# EAGLE design hmesh (EAGLE 6.5.0)
REV: A

## Sheet 1 of 3: CC110L
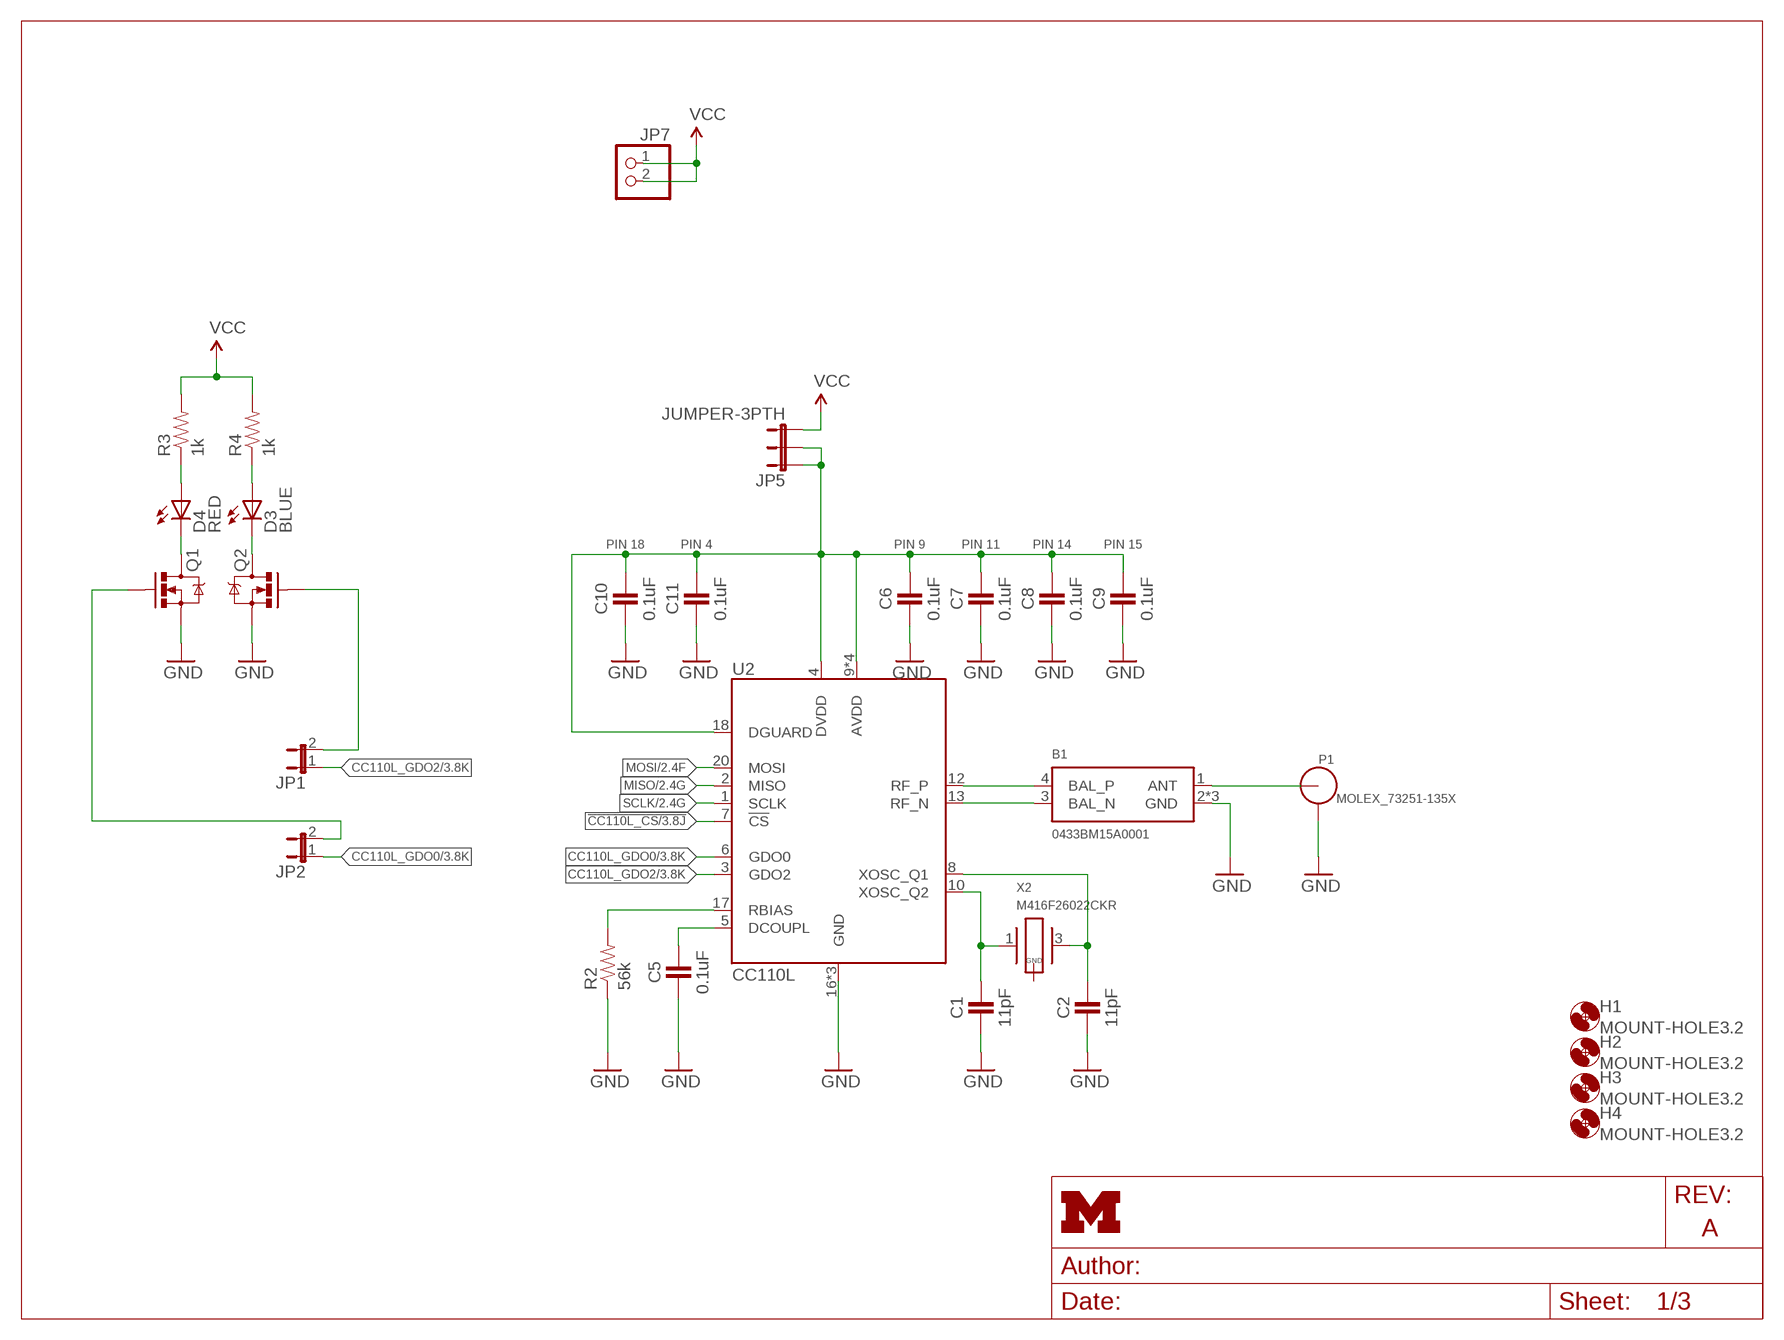
[diagram p0: schematic, sheet 1]
FRAME1 (LETTER_L): HEIGHT: 8.5in; WIDTH: 11in

### Parts
B1  0433BM15A0001  [2450BM]
C1  11pF  CAPACITOR  [0402_CAP]
C2  11pF  CAPACITOR  [0402_CAP]
C5  0.1uF  CAPACITOR  [0402_CAP]
C6  0.1uF  CAPACITOR  [0402_CAP]
C7  0.1uF  CAPACITOR  [0402_CAP]
C8  0.1uF  CAPACITOR  [0402_CAP]
C9  0.1uF  CAPACITOR  [0402_CAP]
C10  0.1uF  CAPACITOR  [0402_CAP]
C11  0.1uF  CAPACITOR  [0402_CAP]
D3  BLUE  LED0603  [LED-0603]
D4  RED  LED0603  [LED-0603]
H1  MOUNT-HOLE3.2  [3,2]
H2  MOUNT-HOLE3.2  [3,2]
H3  MOUNT-HOLE3.2  [3,2]
H4  MOUNT-HOLE3.2  [3,2]
JP1  JUMPER-2PTH  [1X02]
JP2  JUMPER-2PTH  [1X02]
JP5  JUMPER-3PTH  [1X03]
JP7  PINHD-1X2  [1X02]
P1  MOLEX_73251-135X  [SMA-J/PCB]
Q1  MOSFET-NCHANNELSMD  [SOT23-3]
Q2  MOSFET-NCHANNELSMD  [SOT23-3]
R2  56k  RESISTOR0402_RES  [0402_RES]
R3  1k  RESISTOR0402_RES  [0402_RES]
R4  1k  RESISTOR0402_RES  [0402_RES]
U2  CC110L  [S-PVQFN-N20]
X2  M416F26022CKR  [M416]

### Nets
!CC110L_CS: U2.7(!CS) ; also sheet 3
CC110L_GDO0: JP2.1 U2.6(GDO0) ; also sheet 3
CC110L_GDO2: JP1.1 U2.3(GDO2) ; also sheet 3
GND: B1.2(GND) B1.5(GND) B1.6(GND) C1.2 C2.2 C5.2 C6.2 C7.2 C8.2 C9.2 C10.2 C11.2 P1.2 P1.3 P1.4 P1.5 Q1.2(S) Q2.2(S) R2.1 U2.16(GND) U2.19(GND) U2.PAD(GND) ; also sheet 2,3
MISO: U2.2(MISO) ; also sheet 2,3
MOSI: U2.20(MOSI) ; also sheet 2,3
N$1: B1.4(BAL_P) U2.12(RF_P)
N$2: B1.3(BAL_N) U2.13(RF_N)
N$3: B1.1(ANT) P1.1(ANT)
N$6: C1.1 U2.10(XOSC_Q2) X2.1
N$8: C2.1 U2.8(XOSC_Q1) X2.3
N$9: C5.1 U2.5(DCOUPL)
N$10: R2.2 U2.17(RBIAS)
N$12: D4.C Q1.3(D)
N$13: D3.C Q2.3(D)
N$14: JP2.2 Q1.1(G)
N$15: JP1.2 Q2.1(G)
N$24: D4.A R3.1
N$25: D3.A R4.1
SCLK: U2.1(SCLK) ; also sheet 2,3
VCC: JP5.3 JP7.1 JP7.2 R3.2 R4.2 ; also sheet 2,3
VCC_CC110L: C6.1 C7.1 C8.1 C9.1 C10.1 C11.1 JP5.1 JP5.2 U2.4(DVDD) U2.9(AVDD) U2.11(AVDD) U2.14(AVDD) U2.15(AVDD) U2.18(DGUARD)
Unconnected: X2.2(GND) X2.4(GND)

### Notes on the sheet
- PIN 18 | PIN 4 | PIN 9 | PIN 11 | PIN 14 | PIN 15

## Sheet 2 of 3: AS3930
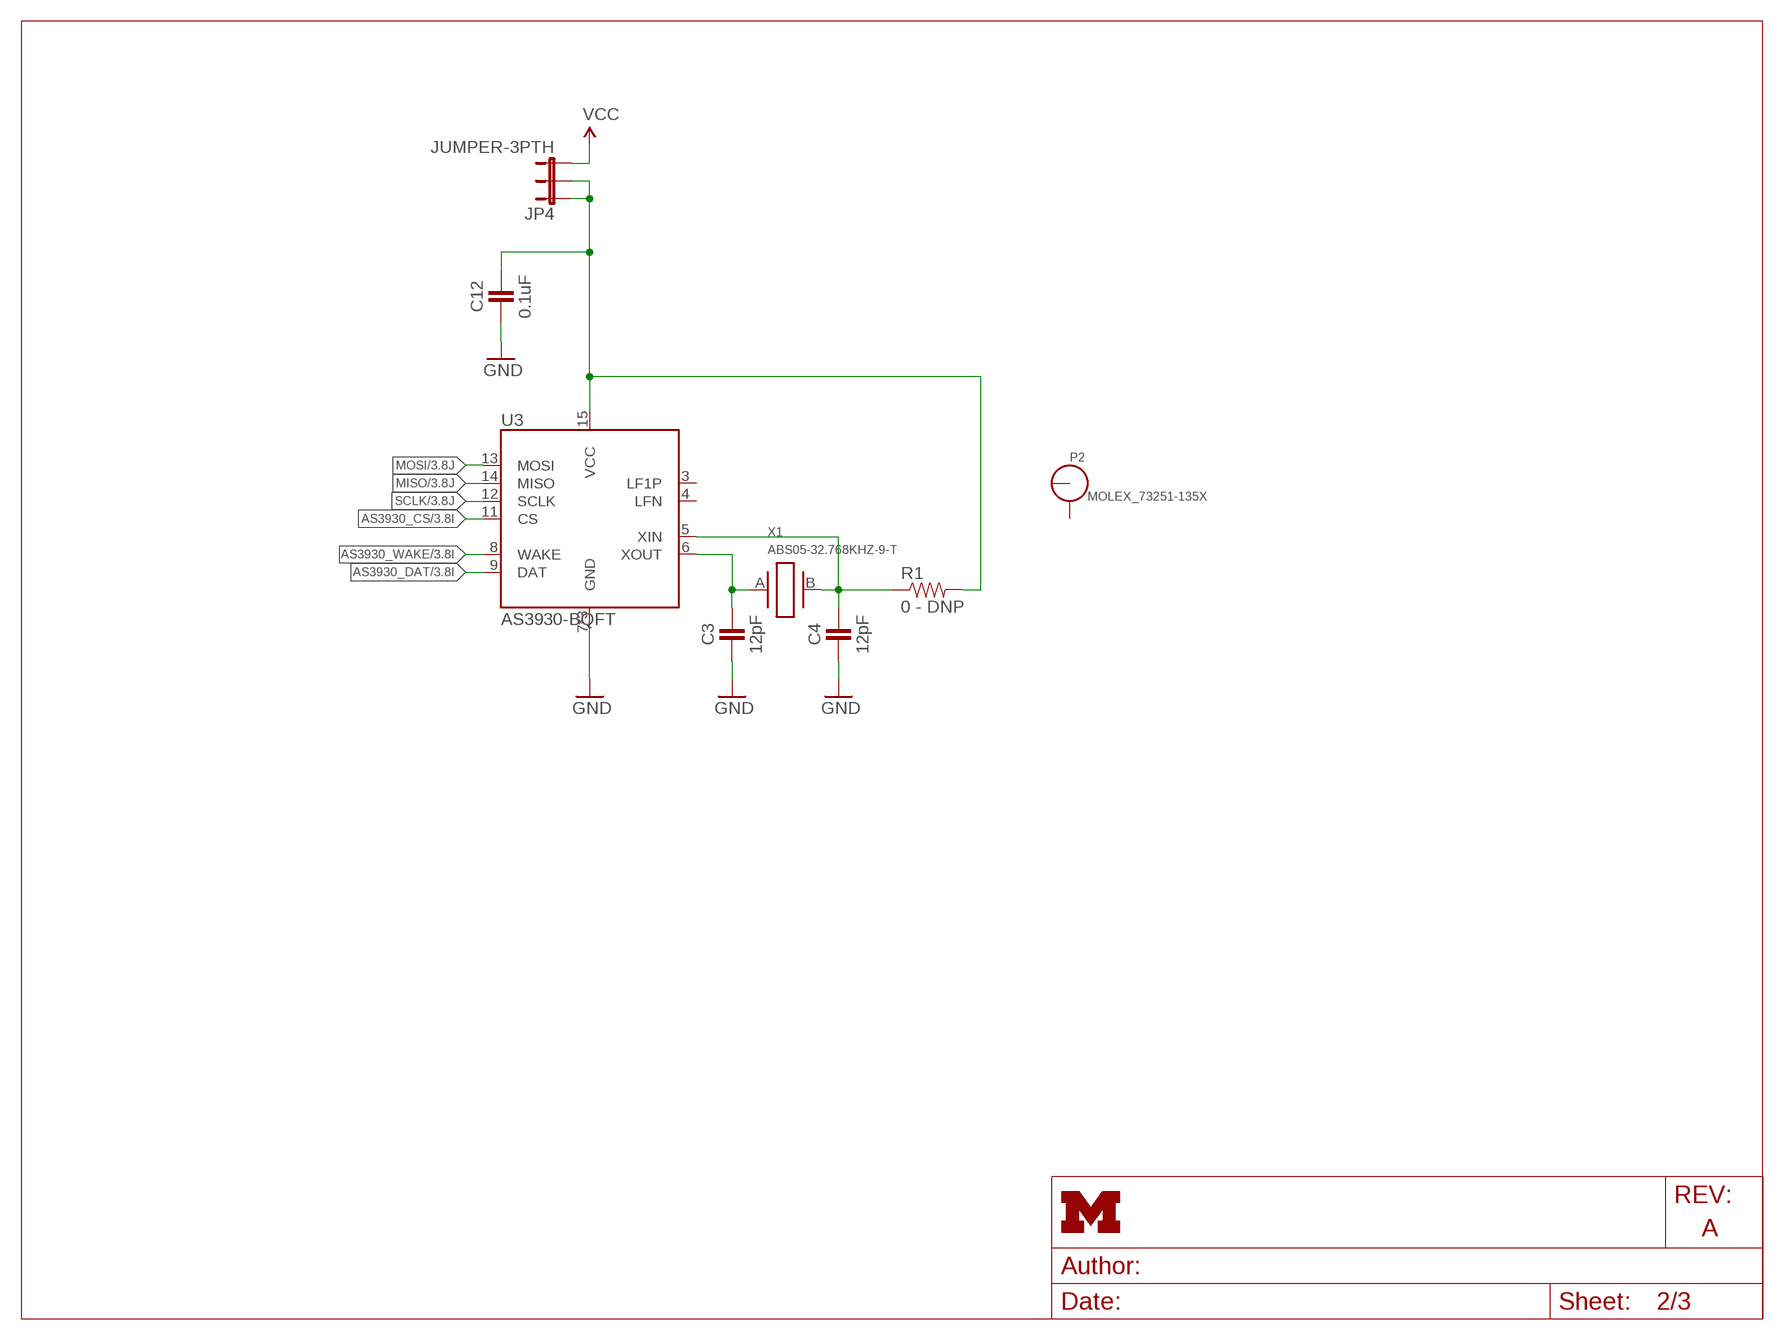
[diagram p1: schematic, sheet 2]
FRAME2 (LETTER_L): HEIGHT: 8.5in; WIDTH: 11in

### Parts
C3  12pF  CAPACITOR  [0402_CAP]
C4  12pF  CAPACITOR  [0402_CAP]
C12  0.1uF  CAPACITOR  [0402_CAP]
JP4  JUMPER-3PTH  [1X03]
P2  MOLEX_73251-135X  [SMA-J/PCB]
R1  0 - DNP  RESISTOR  [0603-RES]
U3  AS3930-BQFT  [QFN-16-4MM]
X1  ABS05-32.768KHZ-9-T  [ABS05]

### Nets
AS3930_CS: U3.11(CS) ; also sheet 3
AS3930_DAT: U3.9(DAT) ; also sheet 3
AS3930_WAKE: U3.8(WAKE) ; also sheet 3
GND: C3.2 C4.2 C12.2 U3.7(GND) U3.16(GND) U3.GND ; also sheet 1,3
MISO: U3.14(MISO) ; also sheet 1,3
MOSI: U3.13(MOSI) ; also sheet 1,3
N$4: C3.1 U3.6(XOUT) X1.A
N$7: C4.1 R1.1 U3.5(XIN) X1.B
SCLK: U3.12(SCLK) ; also sheet 1,3
VCC: JP4.3 ; also sheet 1,3
VCC_AS3930: C12.1 JP4.1 JP4.2 R1.2 U3.15(VCC)
Unconnected: P2.1(ANT) P2.2 P2.3 P2.4 P2.5 U3.3(LF1P) U3.4(LFN)

## Sheet 3 of 3: Atum
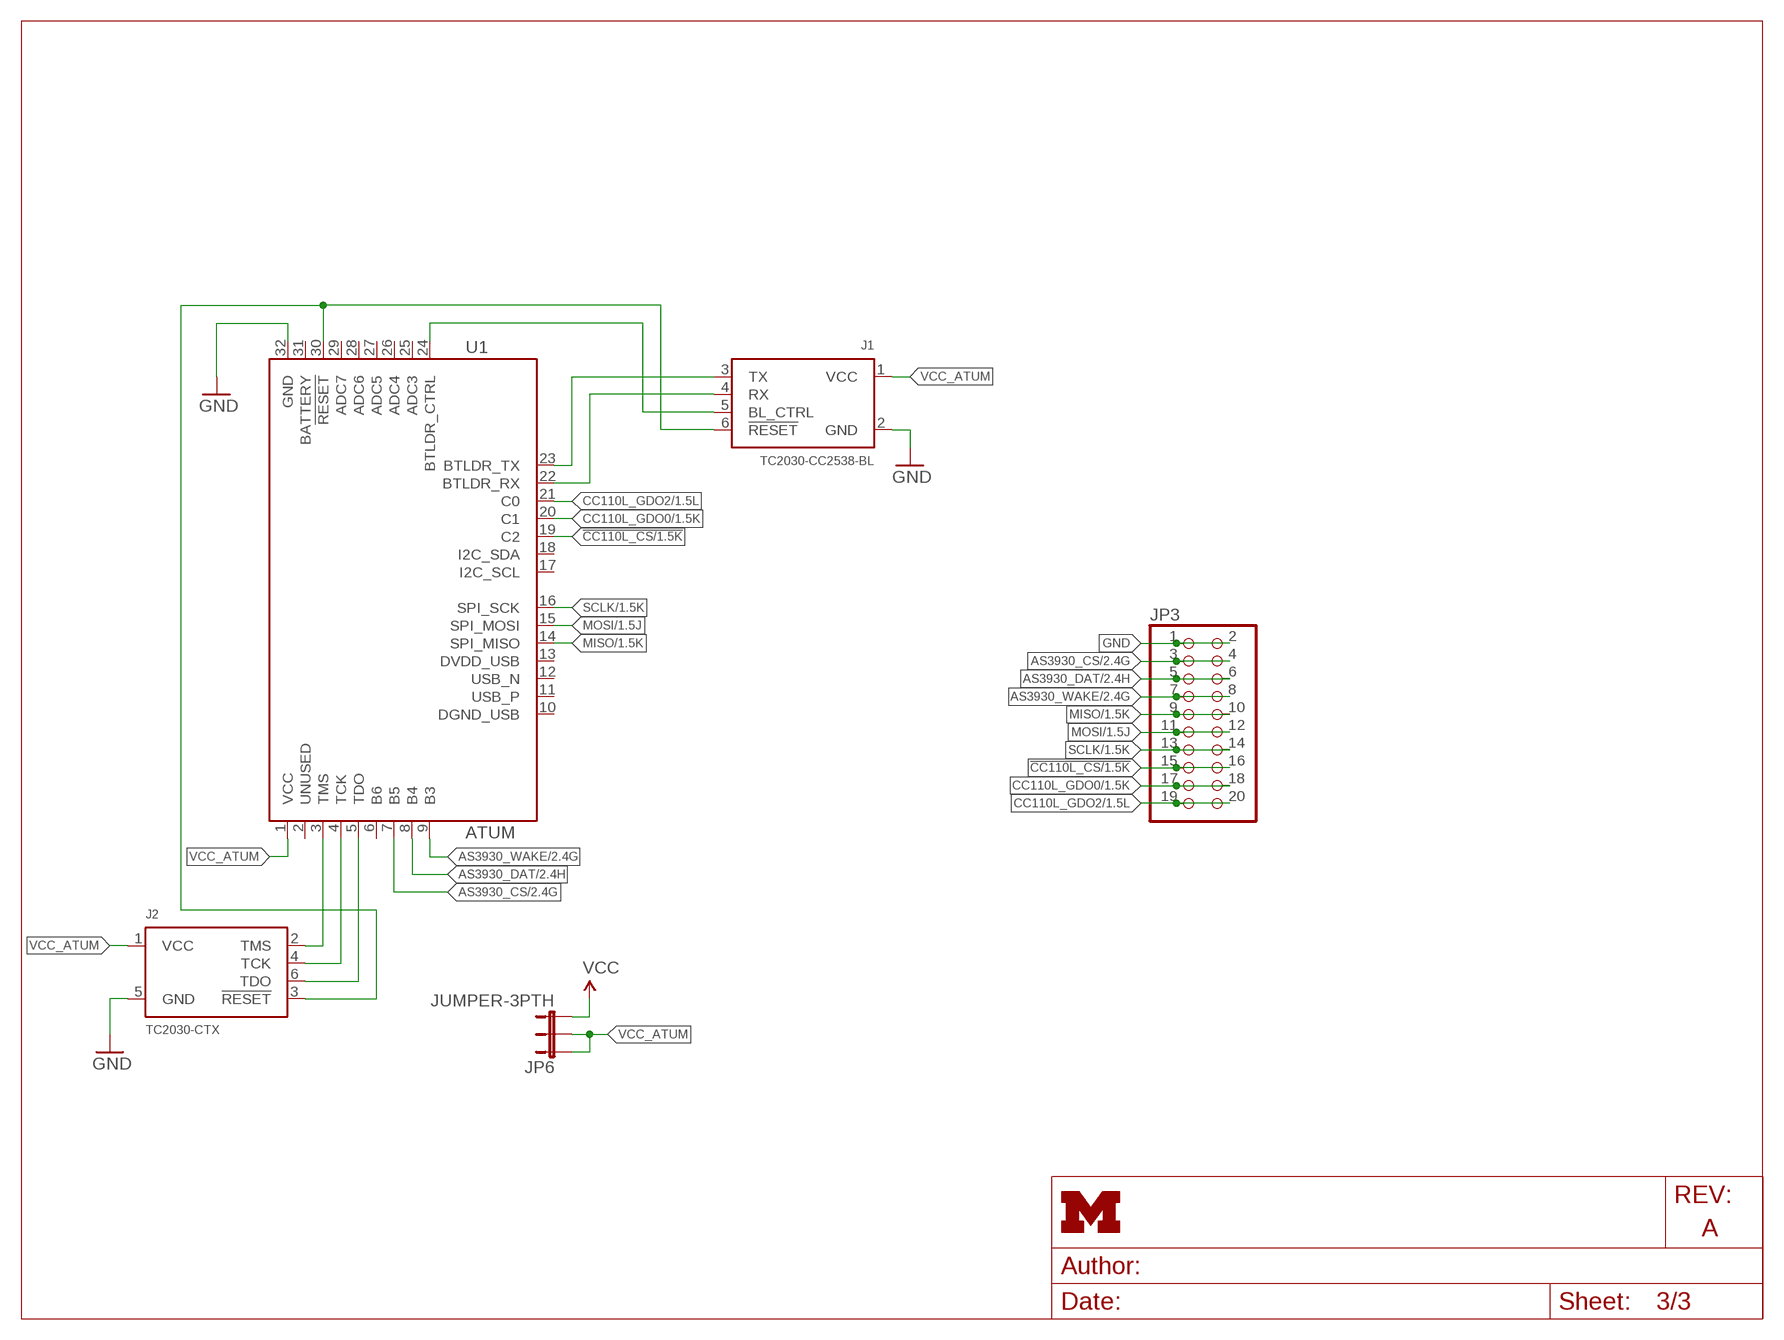
[diagram p2: schematic, sheet 3]
FRAME3 (LETTER_L): HEIGHT: 8.5in; WIDTH: 11in

### Parts
J1  TC2030-CC2538-BL  [TC2030-IDC]
J2  TC2030-CTX  [TC2030-IDC]
JP3  PINHD-2X10  [2X10]
JP6  JUMPER-3PTH  [1X03]
U1  ATUM  [ATUM]

### Nets
!CC110L_CS: JP3.15 JP3.16 U1.19(C2) ; also sheet 1
AS3930_CS: JP3.3 JP3.4 U1.7(B5) ; also sheet 2
AS3930_DAT: JP3.5 JP3.6 U1.8(B4) ; also sheet 2
AS3930_WAKE: JP3.7 JP3.8 U1.9(B3) ; also sheet 2
CC110L_GDO0: JP3.17 JP3.18 U1.20(C1) ; also sheet 1
CC110L_GDO2: JP3.19 JP3.20 U1.21(C0) ; also sheet 1
GND: J1.2(GND) J2.5(GND) JP3.1 JP3.2 U1.32(GND) ; also sheet 1,2
MISO: JP3.9 JP3.10 U1.14(SPI_MISO) ; also sheet 1,2
MOSI: JP3.11 JP3.12 U1.15(SPI_MOSI) ; also sheet 1,2
N$17: J1.3(TX) U1.23(BTLDR_TX)
N$18: J1.4(RX) U1.22(BTLDR_RX)
N$19: J1.5(BL_CTRL) U1.24(BTLDR_CTRL)
N$20: J1.6(!RESET) J2.3(!RESET) U1.30(!RESET)
N$22: J2.2(TMS) U1.3(TMS)
N$23: J2.4(TCK) U1.4(TCK)
N$26: J2.6(TDO) U1.5(TDO)
SCLK: JP3.13 JP3.14 U1.16(SPI_SCK) ; also sheet 1,2
VCC: JP6.3 ; also sheet 1,2
VCC_ATUM: J1.1(VCC) J2.1(VCC) JP6.1 JP6.2 U1.1(VCC)
Unconnected: U1.2(UNUSED) U1.6(B6) U1.10(DGND_USB) U1.11(USB_P) U1.12(USB_N) U1.13(DVDD_USB) U1.17(I2C_SCL) U1.18(I2C_SDA) U1.25(ADC3) U1.26(ADC4) U1.27(ADC5) U1.28(ADC6) U1.29(ADC7) U1.31(BATTERY)

## Library data of the parts
B1 = chips:0433BM15A0001: 433 MHz Balun; DIGIKEY: 712-1540-1-ND
C1 C2 = passives:CAPACITOR: 0402 Capacitor; DIGIKEY: 490-5923-1-ND
C3 C4 = passives:CAPACITOR: 0402 Capacitor; DIGIKEY: 490-6197-1-ND
C5-C12 = passives:CAPACITOR: 0402 Capacitor; DIGIKEY: 445-1265-1-ND
D3 D4 = SparkFun-LED:LED: LEDs Standard schematic elements and footprints for 5mm, 3mm, 1206, and 0603 sized LEDs. 5mm - Spark Fun Electronics SKU : COM-00529 (and others)
H1-H4 = holes:MOUNT-HOLE: MOUNTING HOLE with drill center marker
J1 = connector:TC2030-CC2538-BL: Tag connect programmer for the CC2538 bootloader. The RX/TX switch happens on the programmer board, so when using this connect the TX pin to the TX pin on the CC2538 and same for the RX.
J2 = connector:TC2030-CTX: Tag Connect footprint for ARM JTAG. 10 pin ARM Cortex Debug Connector.
JP1 JP2 = SparkFun-Passives:JUMPER-2: Jumper Basic 0.1" spaced jumper. Use with breakaway headers.
JP3 = pinhead:PINHD-2X10: PIN HEADER
JP4-JP6 = SparkFun-Passives:JUMPER-3
JP7 = pinhead:PINHD-1X2: PIN HEADER
P1 P2 = connector:MOLEX_73251-135X: SMA JACK SMT 50 OHM; DIGIKEY: WM9357-ND
Q1 Q2 = fets:MOSFET-NCHANNEL: Generic NMOS footprint; DIGIKEY: 568-5818-1-ND
R1 R3 R4 = passives:RESISTOR: Resistor Basic schematic elements and footprints for 0603, 1206, and PTH resistors.
R2 = passives:RESISTOR: Resistor Basic schematic elements and footprints for 0603, 1206, and PTH resistors.; DIGIKEY: RHM56KBHCT-ND
U1 = atum:ATUM: Atum sensorboard prototyping module.
U2 = chips:CC110L: The CC110L is a cost optimized sub-1 GHz RF transceiver for the 300–348 MHz, 387–464 MHz, and 779–928 MHz frequency bands.; DIGIKEY: 296-35719-1-ND
U3 = chips:AS3930: Single Channel Low Frequency Wakeup Receiver; DIGIKEY: AS3930-BQFTCT-ND
X1 = crystals:ABS05-32.768KHZ: 32.768kHz Crystal; DIGIKEY: 535-11897-1-ND
X2 = crystals:M416; DIGIKEY: CTX1407CT-ND

## Board
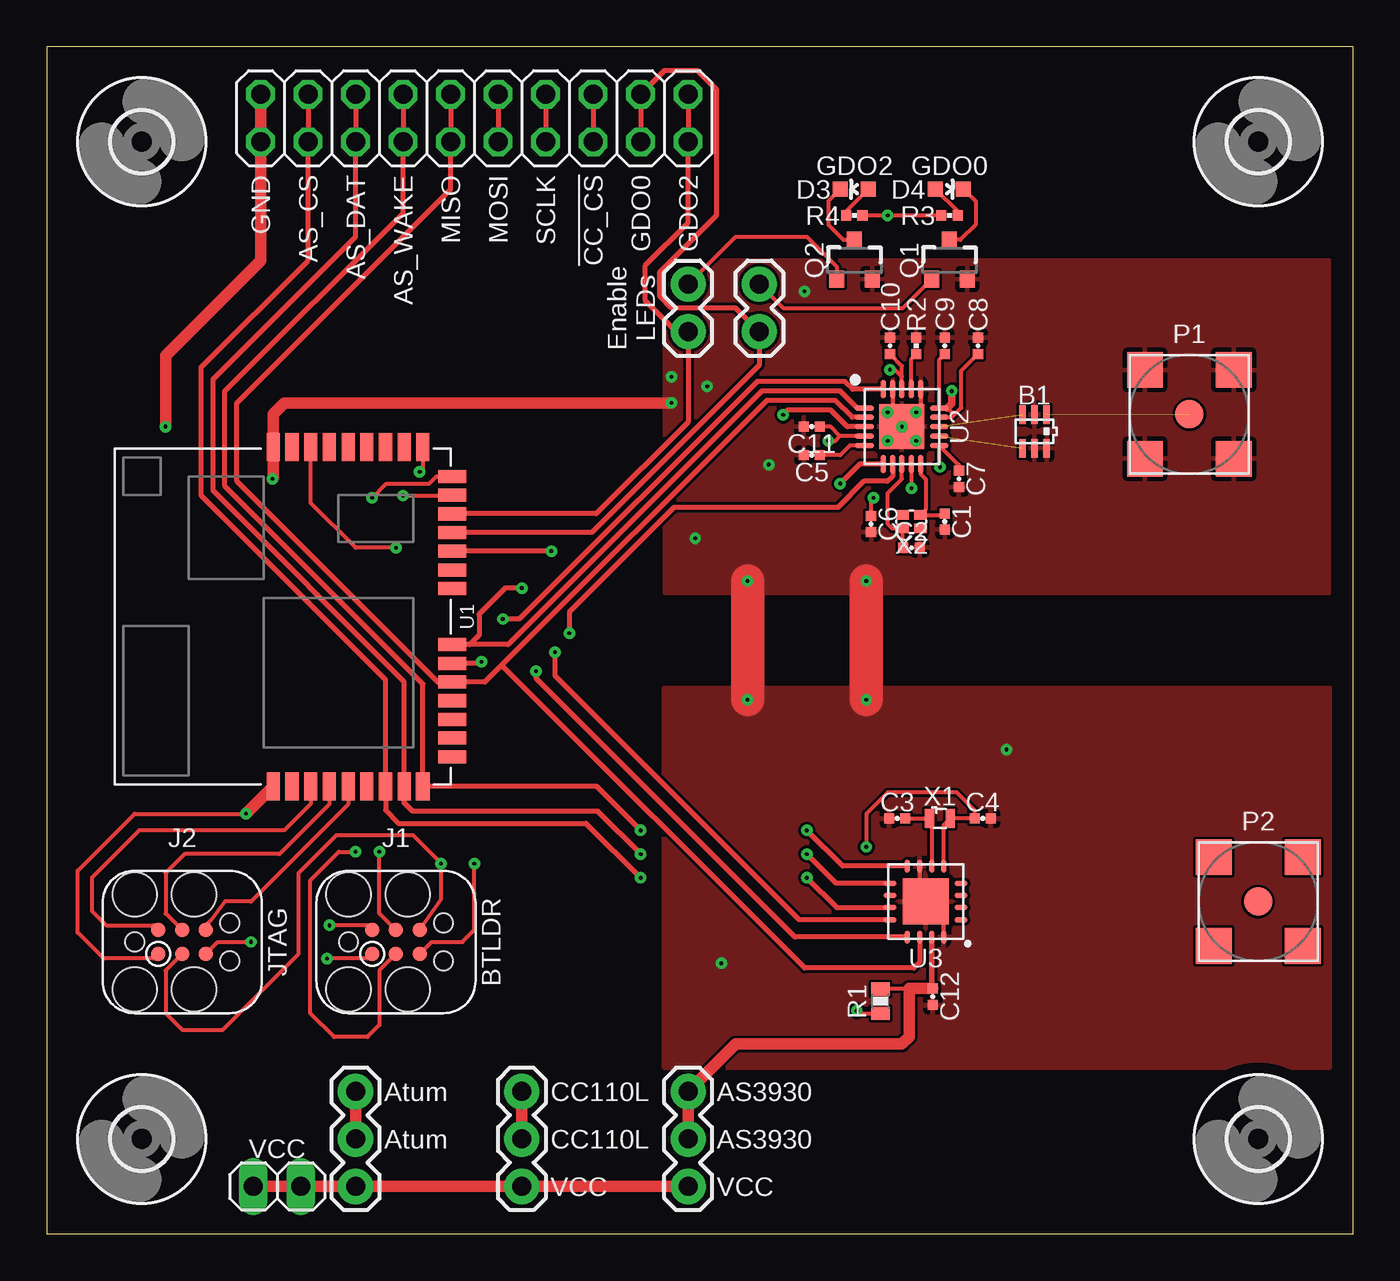
[diagram p3: board, top side]
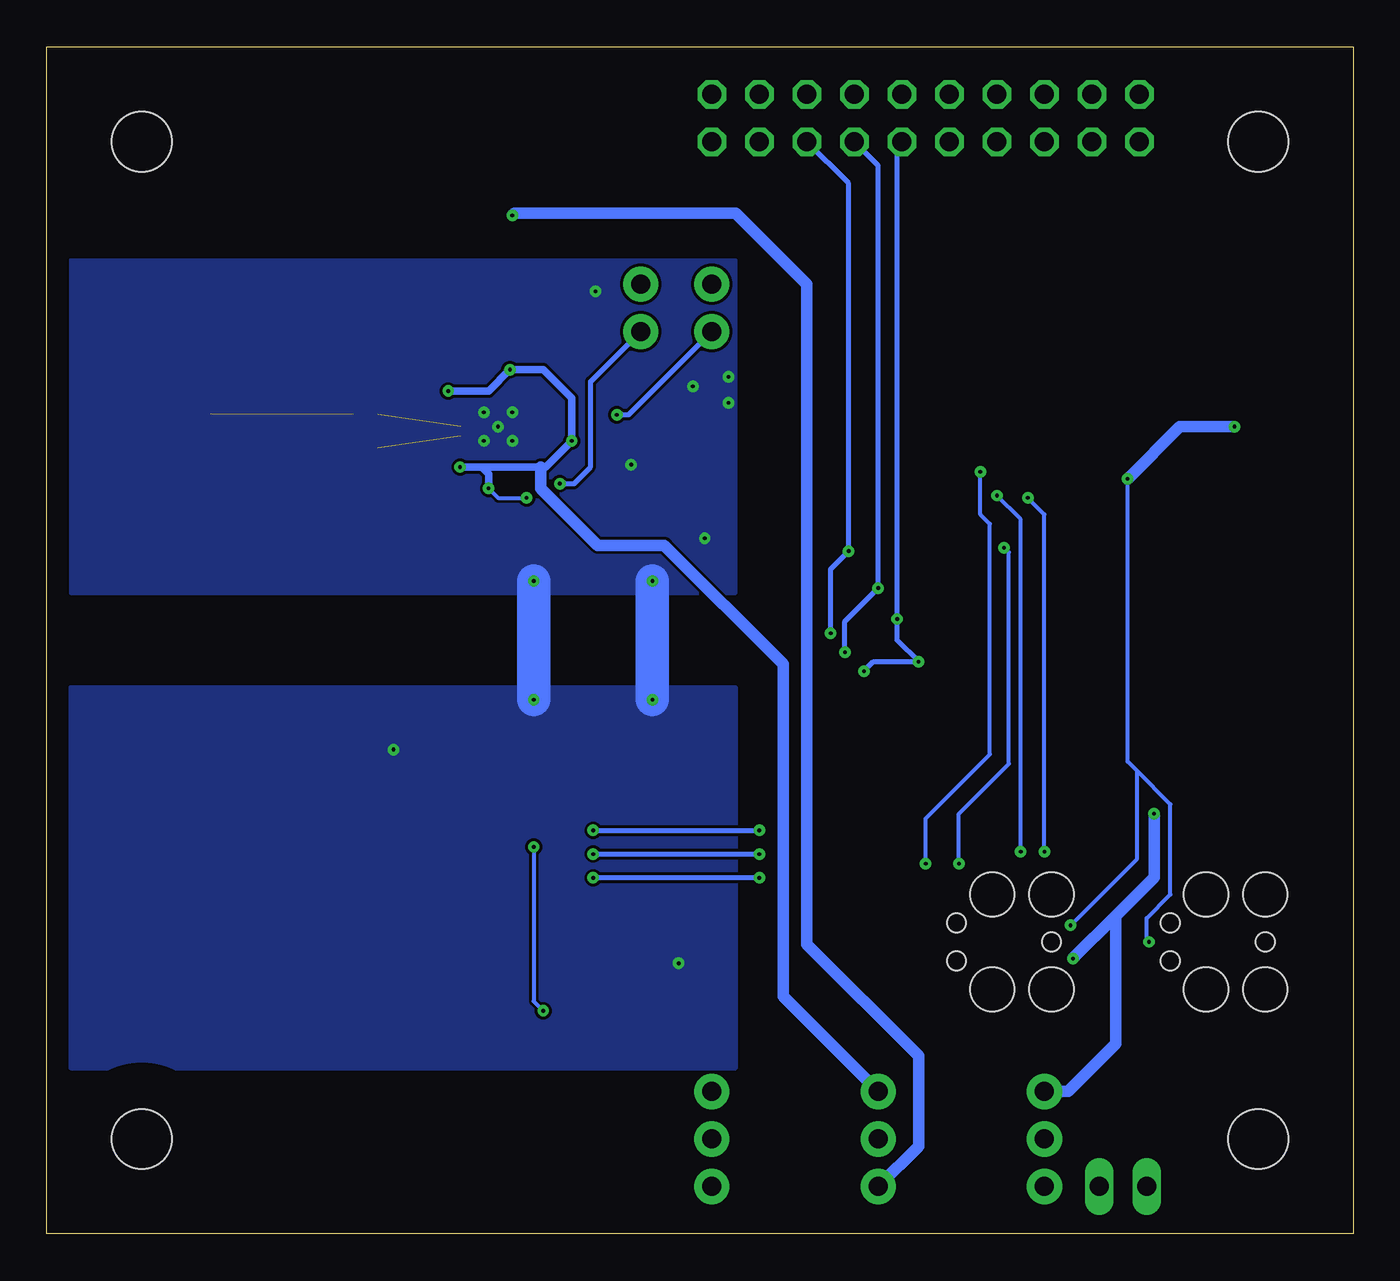
[diagram p4: board, bottom side, seen from below]

Size 69.85 x 63.5 mm. Coordinates in mm from the lower left corner, seen from the top.
Outline: 0,0 69.85,0 69.85,63.5 0,63.5 0,0
Copper layers (1*16): Top 0.0178mm / dielectric 59mil / Bottom 0.0178mm
Design rules "sunstone-2lyr_v1.0.0.3": minimum track width 6mil, minimum drill 14mil, track to track 6mil, track to pad 6mil, pad to pad 6mil, via to via 6mil, smd to smd 6mil, copper to edge 20mil, drill to drill 16mil, minimum pad ring 8mil, minimum via ring 8mil, stop-mask expansion 3mil, vias tented up to drill 50mil, thermal gap 10mil

### Footprints (pad centres in the part's own frame; a part is rotated, then mirrored left to right if it is on the bottom)
2450BM = smd 0.35 x 1: 1 0.65,0.9; 2 0,0.9; 3 -0.65,0.9; 4 -0.65,-0.9; 5 0,-0.9; 6 0.65,-0.9
0402_CAP = smd 0.536 x 0.546: 1 -0.433,0; 2 0.433,0
LED-0603 = smd 0.8 x 0.8: A 0,-0.75; C 0,0.75
3,2 = hole 3.2: 0,0
TC2030-IDC = smd 0.787 x 0.787: 1 -1.27,-0.635; 2 -1.27,0.635; 3 0,-0.635; 4 0,0.635; 5 1.27,-0.635; 6 1.27,0.635 | hole 2.375: -2.54,2.54; 0.635,2.54; 0.635,-2.54; -2.54,-2.54 | hole 1.016: -2.54,0; 2.54,1.016; 2.54,-1.016
1X02 = drill 1.016 pad 1.88: 1 0,0; 2 2.54,0
2X10 = drill 1.016 octagon: 1 -11.43,-1.27; 2 -11.43,1.27; 3 -8.89,-1.27; 4 -8.89,1.27; 5 -6.35,-1.27; 6 -6.35,1.27; 7 -3.81,-1.27; 8 -3.81,1.27; 9 -1.27,-1.27; 10 -1.27,1.27; 11 1.27,-1.27; 12 1.27,1.27; 13 3.81,-1.27; 14 3.81,1.27; 15 6.35,-1.27; 16 6.35,1.27; 17 8.89,-1.27; 18 8.89,1.27; 19 11.43,-1.27; 20 11.43,1.27
1X03 = drill 1.016 pad 1.88: 1 0,0; 2 2.54,0; 3 5.08,0
1X02' = drill 1.016 long: 1 -1.27,0; 2 1.27,0
SMA-J/PCB = smd 1.52 x 1.52: 1 0,0 | smd 1.91 x 1.91: 2 -2.375,-2.375; 3 2.375,-2.375; 4 2.375,2.375; 5 -2.375,2.375
SOT23-3 = smd 0.8 x 0.9: 1 -0.95,-1; 2 0.95,-1; 3 0,1.1
0603-RES = smd 0.7 x 1: 1 -0.65,0; 2 0.65,0
0402_RES = smd 0.536 x 0.546: 1 -0.433,0; 2 0.433,0
ATUM = smd 0.7 x 1.5: 1 -9.479,-9.079; 2 -8.479,-9.079; 3 -7.479,-9.079; 4 -6.479,-9.079; 5 -5.479,-9.079; 6 -4.479,-9.079; 7 -3.479,-9.079; 8 -2.479,-9.079; 24 -1.479,9.079; 25 -2.479,9.079; 26 -3.479,9.079; 27 -4.479,9.079; 28 -5.479,9.079; 29 -6.479,9.079; 30 -7.479,9.079; 31 -8.479,9.079; 32 -9.479,9.079 | smd 0.754 x 1.5: 9 -1.479,-9.079 | smd 1.5 x 0.7: 10 0.1,-7.5; 11 0.1,-6.5; 12 0.1,-5.5; 13 0.1,-4.5; 14 0.1,-3.5; 15 0.1,-2.5; 16 0.1,-1.5; 17 0.1,1.5; 18 0.1,2.5; 19 0.1,3.5; 20 0.1,4.5; 21 0.1,5.5; 22 0.1,6.5; 23 0.1,7.5
S-PVQFN-N20 = smd 0.3 x 1: 1 -1,-2; 2 -0.5,-2; 3 0,-2; 4 0.5,-2; 5 1,-2; 11 1,2; 12 0.5,2; 13 0,2; 14 -0.5,2; 15 -1,2 | smd 1 x 0.3: 6 2,-1; 7 2,-0.5; 8 2,0; 9 2,0.5; 10 2,1; 16 -2,1; 17 -2,0.5; 18 -2,0; 19 -2,-0.5; 20 -2,-1 | smd 2.4 x 2.4: PAD 0,0
QFN-16-4MM = smd 0.7 x 0.3: 1 -1.9,0.975; 2 -1.9,0.325; 3 -1.9,-0.325; 4 -1.9,-0.975; 9 1.9,-0.975; 10 1.9,-0.325; 11 1.9,0.325; 12 1.9,0.975 | smd 0.3 x 0.7: 5 -0.975,-1.9; 6 -0.325,-1.9; 7 0.325,-1.9; 8 0.975,-1.9; 13 0.975,1.9; 14 0.325,1.9; 15 -0.325,1.9; 16 -0.975,1.9 | smd 2.45 x 2.45: GND 0,0
ABS05 = smd 0.5 x 1: A -0.55,0; B 0.55,0
M416 = smd 0.67 x 0.52: 1 -0.485,-0.36; 2 0.485,-0.36; 3 0.485,0.36; 4 -0.485,0.36

### Placement (x,y rotation side)
B1  52.81,42.93 0 top
C1  48.01,38.1 270 top
C2  46.23,36.7 0 top
C3  45.47,22.23 180 top
C4  50.04,22.23 0 top
C5  40.89,41.66 180 top
C6  44.07,37.97 270 top
C7  48.77,40.39 270 top
C8  49.78,47.5 90 top
C9  48.01,47.5 90 top
C10  45.09,47.5 90 top
C11  40.89,43.18 180 top
C12  47.37,12.7 270 top
D3  43.18,55.88 90 top
D4  48.26,55.88 270 top
H1  5.08,5.08 0 top
H2  64.77,5.08 0 top
H3  64.77,58.42 0 top
H4  5.08,58.42 0 top
J1  18.67,15.62 0 top
J2  7.24,15.62 0 top
JP1  34.29,48.26 90 top
JP2  38.1,48.26 90 top
JP3  22.86,59.69 0 top
JP4  34.29,7.62 270 top
JP5  25.4,7.62 270 top
JP6  16.51,7.62 270 top
JP7  [1X02']  12.32,2.54 0 top
P1  61.09,43.84 0 top
P2  64.77,17.78 0 top
Q1  48.26,52.07 0 top
Q2  43.18,52.07 0 top
R1  44.58,12.45 90 top
R2  46.48,47.5 270 top
R3  48.26,54.48 180 top
R4  43.18,54.48 0 top
U1  21.59,33.02 0 top
U2  45.72,43.18 270 top
U3  46.99,17.78 180 top
X1  47.75,22.23 0 top
X2  46.23,38.1 180 top

### Tracks (layer width: path | path; a pad name or v marks a point on that pad's centre or on a via)
!CC110L_CS  (via drill 0.2)
  Top 0.279: U2.7 45.22,40.52 44.96,40.26 43.69,40.26 42.29,38.86 33.53,38.86 27.94,33.27 v27.94,32.13 | v26.98,36.52 U1.19 | JP3.16 JP3.15
  Bottom 0.279: v27.94,32.13 27.94,35.56 v26.98,36.52 26.98,56.19 JP3.15
AS3930_CS  (via drill 0.2)
  Top 0.279: v31.75,19.05 28.83,21.97 18.8,21.97 18.11,22.66 U1.7 18.11,29.64 8.26,39.5 8.26,46.35 13.97,52.07 JP3.3 JP3.4 | v40.64,19.05 42.23,17.45 U3.11
  Bottom 0.279: v31.75,19.05 v40.64,19.05
AS3930_DAT  (via drill 0.2)
  Top 0.279: U3.9 42.2,18.75 v40.64,20.32 | v31.75,20.32 29.46,22.61 19.56,22.61 19.11,23.05 U1.8 19.11,29.53 8.89,39.75 8.89,45.72 16.51,53.34 JP3.5 JP3.6
  Bottom 0.279: v40.64,20.32 v31.75,20.32
AS3930_WAKE  (via drill 0.2)
  Top 0.279: U3.8 42.55,19.68 v40.64,21.59 | v31.75,21.59 29.4,23.94 U1.9 20.11,29.42 9.53,40.01 9.53,45.09 19.05,54.61 JP3.7 JP3.8
  Bottom 0.279: v40.64,21.59 v31.75,21.59
CC110L_GDO0  (via drill 0.2)
  Top 0.279: U2.6 43.47,41.18 v42.42,40.13 | U1.20 29.14,37.52 38.1,46.48 JP2.1 36.83,49.53 33.4,49.53 32.77,50.16 32.77,51.44 35.81,54.48 35.81,59.44 35.81,59.69 35.81,61.21 34.8,62.23 33.02,62.23 JP3.18 JP3.17
  Bottom 0.279: v42.42,40.13 41.66,40.13 40.77,41.02 40.77,45.59 JP2.1
CC110L_GDO2  (via drill 0.2)
  Top 0.279: U2.3 42.8,43.18 41.91,44.07 39.62,44.07 v39.37,43.81 | U1.21 29.38,38.52 34.29,43.43 JP1.1 33.66,48.26 32,49.91 32,51.82 34.29,54.1 JP3.19 JP3.20
  Bottom 0.279: v39.37,43.81 38.73,43.81 JP1.1
GND  (via drill 0.2)
  Top 0.203: U2.19 45.22,44.2 v44.96,43.94 | U2.16 46.72,44.18 v46.48,43.94 | U3.7 46.66,18.11 U3.GND 47.97,16.8 U3.16 | J1.2 17.14,16.51 v15.11,16.51 | J2.5 9.14,15.62 v10.92,15.62
  Top 0.61: v12.06,40.39 12.11,40.43 U1.32 12.11,43.86 12.7,44.45 v33.4,44.45 | v6.35,43.18 6.35,46.99 11.43,52.07 JP3.1 JP3.2
  Top 1.778: v43.81,34.92 v43.81,28.57 | v37.47,34.92 v37.47,28.57
  Bottom 0.203: v15.11,16.51 11.56,20.07 11.56,24.77 | v10.92,15.62 11.05,15.75 11.05,16.89 9.78,18.16 9.78,22.99 11.56,24.77 | 11.56,24.77 12.06,25.27 v12.06,40.39
  Bottom 0.61: v6.35,43.18 9.27,43.18 v12.06,40.39
  Bottom 1.778: v43.81,34.92 v43.81,28.57 | v37.47,34.92 v37.47,28.57
  other vias: 45.72,43.18 46.48,42.42 44.96,42.42 40.51,50.42 36.07,14.48 51.31,25.91 34.67,37.21 38.61,41.15 33.4,45.85 35.31,45.34
  pour Top: 68.58,52.07 33.02,52.07 33.02,34.29 68.58,34.29
  pour Bottom: 33.02,52.07 68.58,52.07 68.58,34.29 33.02,34.29
  pour Bottom: 33.02,29.21 68.58,29.21 68.58,8.89 33.02,8.89
  pour Top: 33.02,29.21 68.58,29.21 68.58,8.89 33.02,8.89
MISO
  Top 0.279: U2.2 43.06,43.68 42.16,44.58 38.48,44.58 24.26,30.35 | 24.26,30.35 23.42,29.52 U1.14 20.9,29.52 10.16,40.26 10.16,44.45 21.59,55.88 JP3.9 JP3.10 | U3.14 46.66,14.53 46.35,14.22 40.51,14.22 24.38,30.35 24.26,30.35
MOSI  (via drill 0.2)
  Top 0.279: U2.20 43.09,45.18 42.67,45.59 37.97,45.59 25.27,32.89 v24.38,32.89 | v23.24,30.61 23.15,30.52 U1.15 | U3.13 40,15.88 26.16,29.72 v26.16,30.1 | JP3.12 JP3.11
  Bottom 0.279: v26.16,30.1 25.65,30.61 v23.24,30.61 24.38,31.75 v24.38,32.89 24.38,58.17 JP3.11
N$1  (1 unrouted)
N$2  (1 unrouted)
N$3  (1 unrouted)
N$4
  Top 0.203: U3.6 47.31,22.11 X1.A C3.1
N$6
  Top 0.203: U2.10 46.72,40.66 46.99,40.39 46.99,38.74 X2.1 47.93,38.46 C1.1
N$7  (via drill 0.2)
  Top 0.203: U3.5 47.97,21.89 X1.B C4.1 49.6,22.66 48.64,23.62 44.96,23.62 43.81,22.48 v43.81,20.7 | v43.31,11.94 43.45,11.8 R1.1
  Bottom 0.203: v43.81,20.7 43.81,12.45 v43.31,11.94
N$8
  Top 0.203: U2.8 45.72,40.39 44.96,39.62 44.96,37.97 45.19,37.74 X2.3 45.74,36.76 C2.1
N$9
  Top 0.203: U2.5 42.94,42.18 42.42,41.66 C5.1
N$10
  Top 0.203: U2.17 46.22,46.8 R2.2
N$12
  Top 0.203: D4.C 49.66,55.23 49.66,53.98 48.85,53.17 Q1.3
N$13
  Top 0.203: D3.C 41.78,55.23 41.78,53.98 42.59,53.17 Q2.3
N$14
  Top 0.203: JP2.2 39.37,49.53 45.77,49.53 Q1.1
N$15
  Top 0.203: JP1.2 36.83,53.34 40.64,53.34 42.23,51.75 Q2.1
N$17  (via drill 0.2)
  Top 0.203: J1.3 17.78,14.1 17.78,11.18 17.14,10.54 15.37,10.54 14.1,11.81 14.1,18.92 15.62,20.45 v16.51,20.45 | v17.4,39.37 18.16,40.13 20.45,40.13 20.84,40.52 U1.23
  Bottom 0.203: v16.51,20.45 16.51,38.48 v17.4,39.37
N$18  (via drill 0.2)
  Top 0.203: J1.4 17.78,17.14 v17.78,20.45 | v19.05,39.5 21.67,39.5 U1.22
  Bottom 0.203: v17.78,20.45 17.78,38.23 v19.05,39.5
N$19  (via drill 0.2)
  Top 0.203: J1.5 20.57,15.62 22.23,15.62 22.86,16.26 v22.86,19.81 | U1.24 20.11,40.94 v19.94,40.77
  Bottom 0.203: v22.86,19.81 22.86,22.23 19.43,25.65 19.43,37.97 19.94,38.48 v19.94,40.77
N$20  (via drill 0.2)
  Top 0.203: J1.6 21.08,17.91 v21.08,19.81 19.56,21.34 15.49,21.34 13.46,19.3 13.46,14.99 9.4,10.92 7.24,10.92 6.35,11.81 6.35,14.1 J2.3 | v18.67,36.7 16.51,36.7 14.11,39.1 U1.30
  Bottom 0.203: v21.08,19.81 21.08,22.48 18.41,25.15 18.41,36.45 v18.67,36.7
N$22
  Top 0.203: U1.3 14.11,23 12.7,21.59 4.95,21.59 2.41,19.05 2.41,17.27 3.17,16.51 5.71,16.51 J2.2
N$23
  Top 0.203: U1.4 15.11,22.98 12.45,20.32 7.37,20.32 6.35,19.3 6.35,17.14 J2.4
N$24
  Top 0.203: D4.A 48.69,54.7 R3.1
N$25
  Top 0.203: D3.A 42.75,54.7 R4.1
N$26
  Top 0.203: U1.5 16.11,22.97 10.92,17.78 9.53,17.78 8.76,16.76 8.51,16.51 J2.6
SCLK  (via drill 0.2)
  Top 0.279: U2.1 43.32,44.18 42.42,45.09 38.23,45.09 24.66,31.52 22.61,31.52 | 22.61,31.52 U1.16 | U3.12 40.22,16.8 27.18,29.84 v27.18,31.11 | v25.4,34.54 24.51,34.54 23.11,33.15 23.11,32.03 22.61,31.52 | JP3.14 JP3.13
  Bottom 0.279: v27.18,31.11 27.18,32.77 v25.4,34.54 25.4,57.15 JP3.13
VCC  (via drill 0.2)
  Top 0.203: R4.2 v44.96,54.48 R3.2
  Top 0.61: JP4.3 JP5.3 JP6.3 JP7.2 JP7.1
  Bottom 0.61: JP5.3 23.24,4.7 23.24,9.53 29.21,15.49 29.21,50.8 33.02,54.61 44.83,54.61 v44.96,54.48
VCC_AS3930
  Top 0.203: R1.2 44.61,13.13 46.1,13.13
  Top 0.305: U3.15 47.31,13.19 C12.1
  Top 0.61: JP4.2 JP4.1 36.83,10.16 45.72,10.16 46.1,10.54 46.1,13.13 C12.1
VCC_ATUM  (via drill 0.2)
  Top 0.203: J2.1 5.71,14.73 3.05,14.73 1.65,16.13 1.65,19.43 4.7,22.48 v10.65,22.48 | J1.1 17.14,14.73 v14.99,14.73
  Top 0.61: JP6.2 JP6.1 | U1.1 v10.65,22.48
  Bottom 0.61: v10.65,22.48 10.65,19.07 12.32,17.4 12.7,17.02 | 12.7,17.02 v14.99,14.73 | JP6.1 15.24,7.62 12.7,10.16 12.7,17.02
VCC_CC110L  (via drill 0.2)
  Top 0.203: U2.9 v46.22,39.89 v46.23,39.88 | C7.1 48.77,41.13 U2.11 47.72,41.05 | U2.14 48.38,43.68 | 48.38,43.68 48.9,44.2 48.9,46.18 C8.1 | C9.1 47.72,46.78 U2.15 48.15,44.18 48.38,43.95 48.38,43.68 | U2.18 45.72,45.85 | 45.72,45.85 45.72,46.43 C10.1 | U2.4 42.41,42.68 | 42.41,42.68 41.91,43.18 C11.1 | v41.78,42.42 42.15,42.42 42.41,42.68 | v45.09,46.23 45.34,46.23 45.72,45.85 | C6.1 44.07,39.24 v44.2,39.37
  Top 0.406: 47.72,41.05 v47.75,41.02 | 48.15,44.18 48.39,44.42 v48.39,45.09
  Top 0.61: JP5.2 JP5.1
  Bottom 0.203: v46.23,39.88 45.72,39.37 v44.2,39.37
  Bottom 0.406: v47.75,41.02 46.6,41.02 | 46.6,41.02 46.22,40.64 v46.22,39.89 v46.23,39.88 | 46.6,41.02 43.43,41.02 43.18,41.02 v41.78,42.42 41.78,44.7 43.31,46.23 v45.09,46.23 46.23,45.09 v48.39,45.09
  Bottom 0.61: 43.43,41.02 43.43,39.88 40.39,36.83 36.83,36.83 30.48,30.48 30.48,12.7 JP5.1

### Text on the board
tPlace: GND | AS_CS | AS_DAT | AS_WAKE | MISO | MOSI | SCLK | !CC_CS | GDO0 | GDO2 | GDO2 | GDO0 | Enable / LEDs | JTAG | BTLDR | Atum | CC110L | AS3930 | Atum | CC110L | AS3930 | VCC | VCC | VCC